# Altium schematic sheet Sheet3.SchDoc
size A3; SheetNumber: 1; SheetTotal: 1
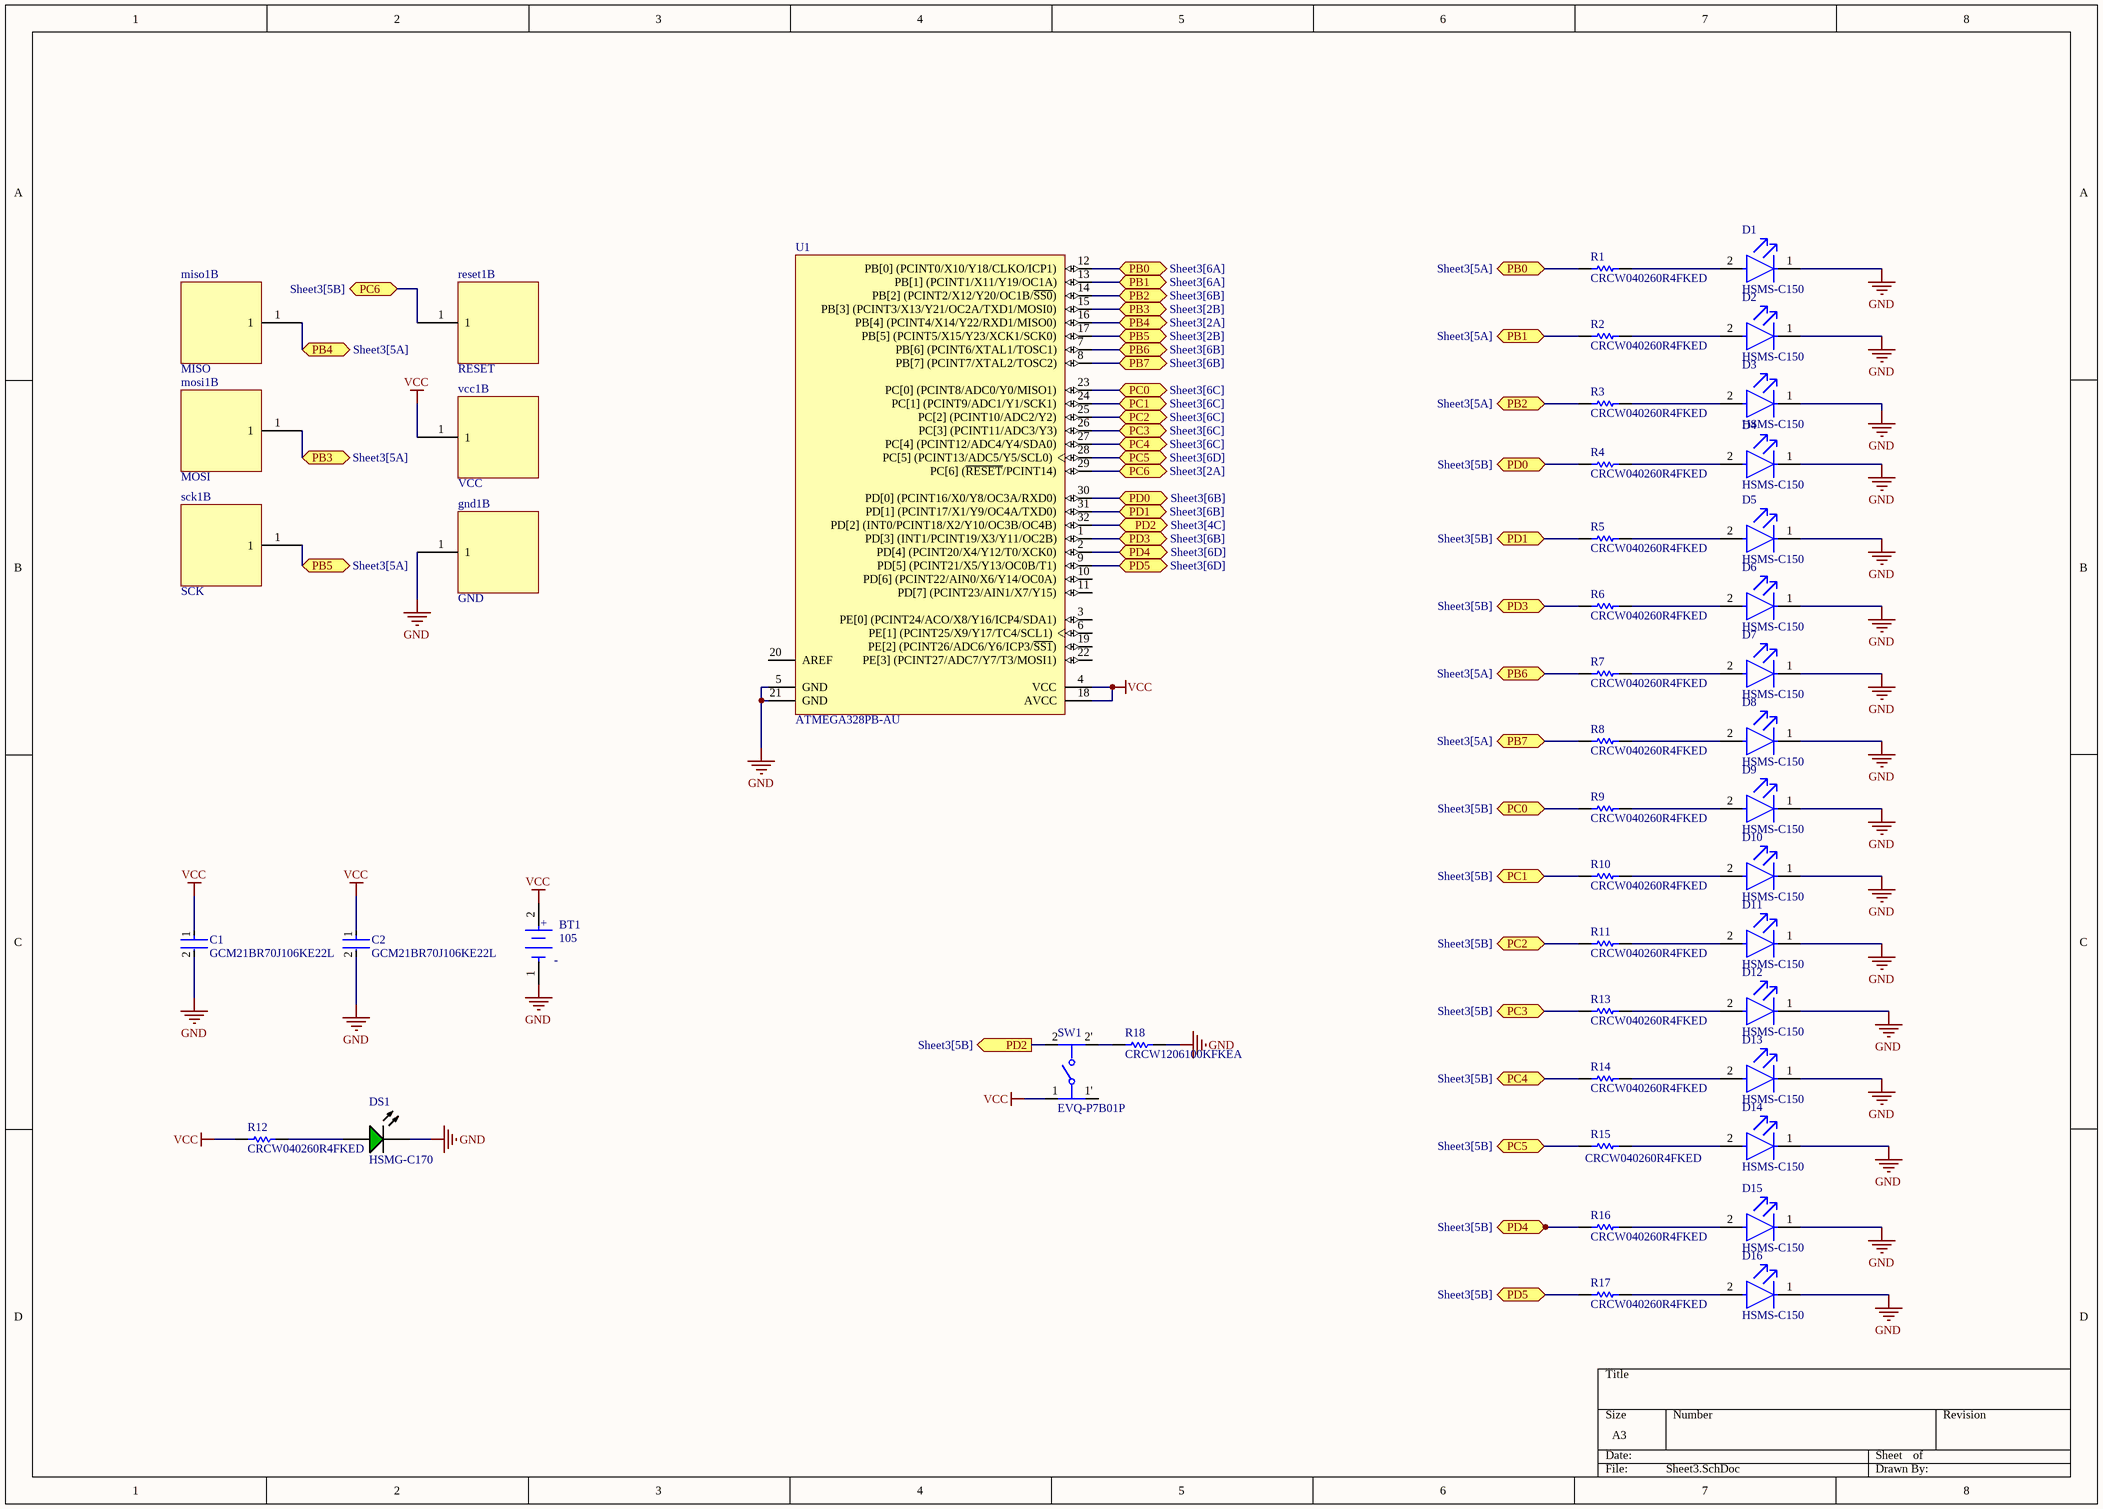
[diagram p0: Sheet3.SchDoc]

## Parts
BT1  105  [FP-105-MFG]
C1  GCM21BR70J106KE22L  [FP-GCM21B-0_15-IPC_C]
C2  GCM21BR70J106KE22L  [FP-GCM21B-0_15-IPC_C]
D1  HSMS-C150  [FP-HSMS-C150-MFG]
D2  HSMS-C150  [FP-HSMS-C150-MFG]
D3  HSMS-C150  [FP-HSMS-C150-MFG]
D4  HSMS-C150  [FP-HSMS-C150-MFG]
D5  HSMS-C150  [FP-HSMS-C150-MFG]
D6  HSMS-C150  [FP-HSMS-C150-MFG]
D7  HSMS-C150  [FP-HSMS-C150-MFG]
D8  HSMS-C150  [FP-HSMS-C150-MFG]
D9  HSMS-C150  [FP-HSMS-C150-MFG]
D10  HSMS-C150  [FP-HSMS-C150-MFG]
D11  HSMS-C150  [FP-HSMS-C150-MFG]
D12  HSMS-C150  [FP-HSMS-C150-MFG]
D13  HSMS-C150  [FP-HSMS-C150-MFG]
D14  HSMS-C150  [FP-HSMS-C150-MFG]
D15  HSMS-C150  [FP-HSMS-C150-MFG]
D16  HSMS-C150  [FP-HSMS-C150-MFG]
DS1  HSMG-C170  [AVAG-HSMX-C170_V]
gnd1  GND  [PCBComponent_1]  (part B of 2)
miso1  MISO  [PCBComponent_1]  (part B of 2)
mosi1  MOSI  [PCBComponent_1]  (part B of 2)
R1  CRCW040260R4FKED  [RESC1005X40X25LL05T05]
R2  CRCW040260R4FKED  [RESC1005X40X25LL05T05]
R3  CRCW040260R4FKED  [RESC1005X40X25LL05T05]
R4  CRCW040260R4FKED  [RESC1005X40X25LL05T05]
R5  CRCW040260R4FKED  [RESC1005X40X25LL05T05]
R6  CRCW040260R4FKED  [RESC1005X40X25LL05T05]
R7  CRCW040260R4FKED  [RESC1005X40X25LL05T05]
R8  CRCW040260R4FKED  [RESC1005X40X25LL05T05]
R9  CRCW040260R4FKED  [RESC1005X40X25LL05T05]
R10  CRCW040260R4FKED  [RESC1005X40X25LL05T05]
R11  CRCW040260R4FKED  [RESC1005X40X25LL05T05]
R12  CRCW040260R4FKED  [RESC1005X40X25LL05T05]
R13  CRCW040260R4FKED  [RESC1005X40X25LL05T05]
R14  CRCW040260R4FKED  [RESC1005X40X25LL05T05]
R15  CRCW040260R4FKED  [RESC1005X40X25LL05T05]
R16  CRCW040260R4FKED  [RESC1005X40X25LL05T05]
R17  CRCW040260R4FKED  [RESC1005X40X25LL05T05]
R18  CRCW1206100KFKEA  [RESC3216X60X45NL10T20]
reset1  RESET  [PCBComponent_1]  (part B of 2)
sck1  SCK  [PCBComponent_1]  (part B of 2)
SW1  EVQ-P7B01P  [FP-EVQ-P7B01P-MFG]
U1  ATMEGA328PB-AU  [ATML-32A_L]
vcc1  VCC  [PCBComponent_1]  (part B of 2)

## Ports
PB0 (bidir, see Sheet3[5A]), PB0 (bidir, see Sheet3[6A]), PB1 (bidir, see Sheet3[5A]), PB1 (bidir, see Sheet3[6A]), PB2 (bidir, see Sheet3[5A]), PB2 (bidir, see Sheet3[6B]), PB3 (bidir, see Sheet3[2B]), PB3 (bidir, see Sheet3[5A]), PB4 (bidir, see Sheet3[2A]), PB4 (bidir, see Sheet3[5A]), PB5 (bidir, see Sheet3[2B]), PB5 (bidir, see Sheet3[5A]), PB6 (bidir, see Sheet3[5A]), PB6 (bidir, see Sheet3[6B]), PB7 (bidir, see Sheet3[5A]), PB7 (bidir, see Sheet3[6B]), PC0 (bidir, see Sheet3[5B]), PC0 (bidir, see Sheet3[6C]), PC1 (bidir, see Sheet3[5B]), PC1 (bidir, see Sheet3[6C]), PC2 (bidir, see Sheet3[5B]), PC2 (bidir, see Sheet3[6C]), PC3 (bidir, see Sheet3[5B]), PC3 (bidir, see Sheet3[6C]), PC4 (bidir, see Sheet3[5B]), PC4 (bidir, see Sheet3[6C]), PC5 (bidir, see Sheet3[5B]), PC5 (bidir, see Sheet3[6D]), PC6 (bidir, see Sheet3[2A]), PC6 (bidir, see Sheet3[5B]), PD0 (bidir, see Sheet3[5B]), PD0 (bidir, see Sheet3[6B]), PD1 (bidir, see Sheet3[5B]), PD1 (bidir, see Sheet3[6B]), PD2 (bidir, see Sheet3[4C]), PD2 (out, see Sheet3[5B]), PD3 (bidir, see Sheet3[5B]), PD3 (bidir, see Sheet3[6B]), PD4 (bidir, see Sheet3[5B]), PD4 (bidir, see Sheet3[6D]), PD5 (bidir, see Sheet3[5B]), PD5 (bidir, see Sheet3[6D])

## Nets
GND: BT1.1(-) C1.2 C2.2 D1.1(C) D2.1(C) D3.1(C) D4.1(C) D5.1(C) D6.1(C) D7.1(C) D8.1(C) D9.1(C) D10.1(C) D11.1(C) D12.1(C) D13.1(C) D14.1(C) D15.1(C) D16.1(C) DS1.2(K) gnd1.1 R18.1 U1.5(GND) U1.21(GND)
VCC: BT1.2(+) C1.1 C2.1 R12.1 SW1.1 U1.4(VCC) U1.18(AVCC) vcc1.1
PB0: R1.1 U1.12(PB[0]_(PCINT0/X10/Y18/CLKO/ICP1)) ; port PB0
PB1: R2.1 U1.13(PB[1]_(PCINT1/X11/Y19/OC1A)) ; port PB1
PB2: R3.1 U1.14(PB[2]_(PCINT2/X12/Y20/OC1B/~{SS0})) ; port PB2
PB3: mosi1.1 U1.15(PB[3]_(PCINT3/X13/Y21/OC2A/TXD1/MOSI0)) ; port PB3
PB4: miso1.1 U1.16(PB[4]_(PCINT4/X14/Y22/RXD1/MISO0)) ; port PB4
PB5: sck1.1 U1.17(PB[5]_(PCINT5/X15/Y23/XCK1/SCK0)) ; port PB5
PB6: R7.1 U1.7(PB[6]_(PCINT6/XTAL1/TOSC1)) ; port PB6
PB7: R8.1 U1.8(PB[7]_(PCINT7/XTAL2/TOSC2)) ; port PB7
PC0: R9.1 U1.23(PC[0]_(PCINT8/ADC0/Y0/MISO1)) ; port PC0
PC1: R10.1 U1.24(PC[1]_(PCINT9/ADC1/Y1/SCK1)) ; port PC1
PC2: R11.1 U1.25(PC[2]_(PCINT10/ADC2/Y2)) ; port PC2
PC3: R13.1 U1.26(PC[3]_(PCINT11/ADC3/Y3)) ; port PC3
PC4: R14.1 U1.27(PC[4]_(PCINT12/ADC4/Y4/SDA0)) ; port PC4
PC5: R15.1 U1.28(PC[5]_(PCINT13/ADC5/Y5/SCL0)) ; port PC5
PC6: reset1.1 U1.29(PC[6]_(~{RESET}/PCINT14)) ; port PC6
PD0: R4.1 U1.30(PD[0]_(PCINT16/X0/Y8/OC3A/RXD0)) ; port PD0
PD1: R5.1 U1.31(PD[1]_(PCINT17/X1/Y9/OC4A/TXD0)) ; port PD1
PD2: SW1.2 U1.32(PD[2]_(INT0/PCINT18/X2/Y10/OC3B/OC4B)) ; port PD2
PD3: R6.1 U1.1(PD[3]_(INT1/PCINT19/X3/Y11/OC2B)) ; port PD3
PD4: R16.1 U1.2(PD[4]_(PCINT20/X4/Y12/T0/XCK0)) ; port PD4
PD5: R17.1 U1.9(PD[5]_(PCINT21/X5/Y13/OC0B/T1)) ; port PD5
NetD1_2: D1.2(A) R1.2
NetD2_2: D2.2(A) R2.2
NetD3_2: D3.2(A) R3.2
NetD4_2: D4.2(A) R4.2
NetD5_2: D5.2(A) R5.2
NetD6_2: D6.2(A) R6.2
NetD7_2: D7.2(A) R7.2
NetD8_2: D8.2(A) R8.2
NetD9_2: D9.2(A) R9.2
NetD10_2: D10.2(A) R10.2
NetD11_2: D11.2(A) R11.2
NetD12_2: D12.2(A) R13.2
NetD13_2: D13.2(A) R14.2
NetD14_2: D14.2(A) R15.2
NetD15_2: D15.2(A) R16.2
NetD16_2: D16.2(A) R17.2
NetDS1_1: DS1.1(A) R12.2
NetR18_2: R18.2 SW1.2'

Not connected (* = marked no-connect by the designer): SW1 1'; U1 3(PE[0]_(PCINT24/ACO/X8/Y16/ICP4/SDA1)) 6(PE[1]_(PCINT25/X9/Y17/TC4/SCL1)) 10(PD[6]_(PCINT22/AIN0/X6/Y14/OC0A)) 11(PD[7]_(PCINT23/AIN1/X7/Y15)) 19(PE[2]_(PCINT26/ADC6/Y6/ICP3/~{SS1})) 20(AREF) 22(PE[3]_(PCINT27/ADC7/Y7/T3/MOSI1))

## Library data of the parts
BT1 = CMP-00214-00028800-1: 105 Battery Holder Coin Cell 1 Cell PC Pin PCB Through Hole Mount PBT 0.944 in. Dia; NexarPartId: 28800; Number of Contacts: 2; Number of Batteries: 1; Approvals: UL; Wire/Cable Gauge: 1AWG; Body Material: Glass, Nylon, PBT; Material: Plastic, Steel; REACH SVHC: No SVHC; Min Operating Temperature: -50°C; Lead Free: Lead Free; Height: 8.75mm; Diameter: 24mm; Termination: PC Pin; Max Operating Temperature: 145°C; Contact Material: Nickel; Number of Cells: 1; Packaging: Bulk; Contact Plating: Nickel; Mount: PCB, Through Hole; RoHS: Compliant
C1 C2 = CMP-2007-03335-2: Ceramic Capacitor for Automotive 10uF ±10% 6.3VDC X7R 0805 Embossed T/R; Voltage Rating: 6.3V; Voltage: 6.3V; Length: 2mm; Packaging: Tape and Reel; Radiation Hardening: No; Termination: SMD/SMT; Tolerance: 10%; Width: 0.049inch; Max Operating Temperature: 125°C; Mount: Surface Mount; Case/Package: 0805; Case Code (Imperial): 0805; Capacitance: 10uF; Ratings: AEC-Q200; Voltage Rating (DC): 6.3V; Height: 1.25mm; Dielectric: X7R; Case Code (Metric): 2012; Package Quantity: 1; Thickness: 0.055inch; Lead Free: Lead Free; Depth: 1.25mm; Min Operating Temperature: -55°C; REACH SVHC: No SVHC
D1-D16 = CMP-21615-000001-1: LED RED DIFFUSED CHIP SMD; Luminous Intensity: 10mcd; Power Dissipation: 65mW; Viewing Angle: 170°; Number of Elements: 1; Forward Current: 20mA; Lens Color: White; Lens Style: Rectangular; Wavelength: 626nm; Forward Voltage: 2.1V; Reverse Voltage: 5V; Number of Pins: 2; Color: Red; Lead Free: Lead Free; Width: 1.6mm; Length: 3.2mm; REACH SVHC: No SVHC; Height: 1.1mm; Depth: 1.6mm; Power Rating: 65mW; Package Quantity: 1; Illumination Color: Red; Radiation Hardening: No; Case Code (Imperial): 1206; Max Operating Temperature: 85°C; Test Current: 20mA; Case/Package: 1206; Lens Transparency: Diffused; Number of LEDs: 1; Packaging: Tape and Reel; Mount: Surface Mount; Min Operating Temperature: -40°C; Case Code (Metric): 3216; Dominant Wavelength: 626nm
DS1 = CMP-2000-05062-1: Chip LED, Green, 2.2 V, -40 to 85 degC, 2-Pin SMD, Pb-Free, Tape and Reel; Manufacturer: Avago; No. of Pins: 2; Peak Wavelength: 570nm; SVHC: NoSVHC(16-Jun-2014); Dominant Wavelength: 572nm; Forward Current If: 20mA; Viewing Angle: 170deg; Lens Shape: Rectangular; PIV Max: 5V; External Width: 1.25mm; LED Type: Standard; External Depth: 0.8mm; Opto Mounting Orientation: Top; Luminous Intensity: 15mcd; Luminous Intensity Min: 4mcd; Forward Voltage VF Max: 2.6V; External Length / Height: 2mm; Bulb Size: 1.25mmx1.4mm; Light Area Height: 1mm; Voltage Vf Typ: 2.2V; Operating Temperature Max: 85degC; Datasheet Version: Oct-08; MSL: MSL2A-4weeks; Peak Forward Current: 20mA; Package Description: 2-Pin Surface Mount Device, Body 2 x 1.25 mm, Height 0.8 mm; Datasheet URL: https://datasheet.ciiva.com/29280/180495-da-01-en-chip-led-hsmg-c170-gelb-gruen-29280971.pdf; Storage Temperature Min: -40degC; LED Colour: Green; Wavelength Typ: 570nm; Mounting Type: SMD; Forward Current If Max: 20mA; Dominant Wavelength Typ: 572nm; LED Mounting: SMD; Operating Temperature Range: -30degCto+85degC; Operating Temperature Min: -30degC; Manufacturer URL: http://www.avagotech.com/; Packaging: CutTape; Luminous Intensity Typ: 15mcd; Package Reference: HSMX-C170; Storage Temperature Max: 85degC; Opto Case Style: SMD; Forward Voltage: 2.2V
gnd1 miso1 mosi1 reset1 sck1 vcc1 = Component_1: pad for pins
R1-R17 = CMP-2002-00141-1: Manufacturer: Vishay Dale; Part Number: CRCW040260R4FKED
R18 = CMP-1014-00736-2: Manufacturer: Vishay Dale; Part Number: CRCW1206100KFKEA
SW1 = CMP-05618-000129-1: SWITCH TACTILE SPST-NO 0.05A 12V; Switch Travel: 0.2mm; Illumination Type: Non-Illuminated; Switch Function: Off-Mom; Throw Configuration: SPST; Operating Force: 2.2N; Mechanical Life: 100000Cycles; Termination: J-Bend; Max Voltage Rating (DC): 12V; Mount: Surface Mount; Lead Free: Lead Free; Radiation Hardening: No; Package Quantity: 5000; Case/Package: SMD/SMT; Min Operating Temperature: -20°C; Packaging: Tape and Reel; Max Operating Temperature: 70°C
U1 = CMP-2000-07439-1: AVR Microcontroller, 1.8 to 5.5 V, 32 KB Flash, 1 KB EEPROM, 2 KB SRAM, -40 to 85 degC, 32-Pin TQFP (32A), RoHS, Tray; Manufacturer: Microchip; Datasheet URL: http://ww1.microchip.com/downloads/en/DeviceDoc/40001906A.pdf; Mounting Technology: SurfaceMount; RoHSCompliant: false; Manufacturer URL: http://www.microchip.com/; Package Description: 32-Pin Thin Profile Plastic Quad Flat Package, Body 7 x 7 mm, Pitch 0.8 mm; Package Reference: 32A; Datasheet Version: Rev. A, 04/2017